# EAGLE design Sled_5A_v1 (EAGLE 9.6.2)
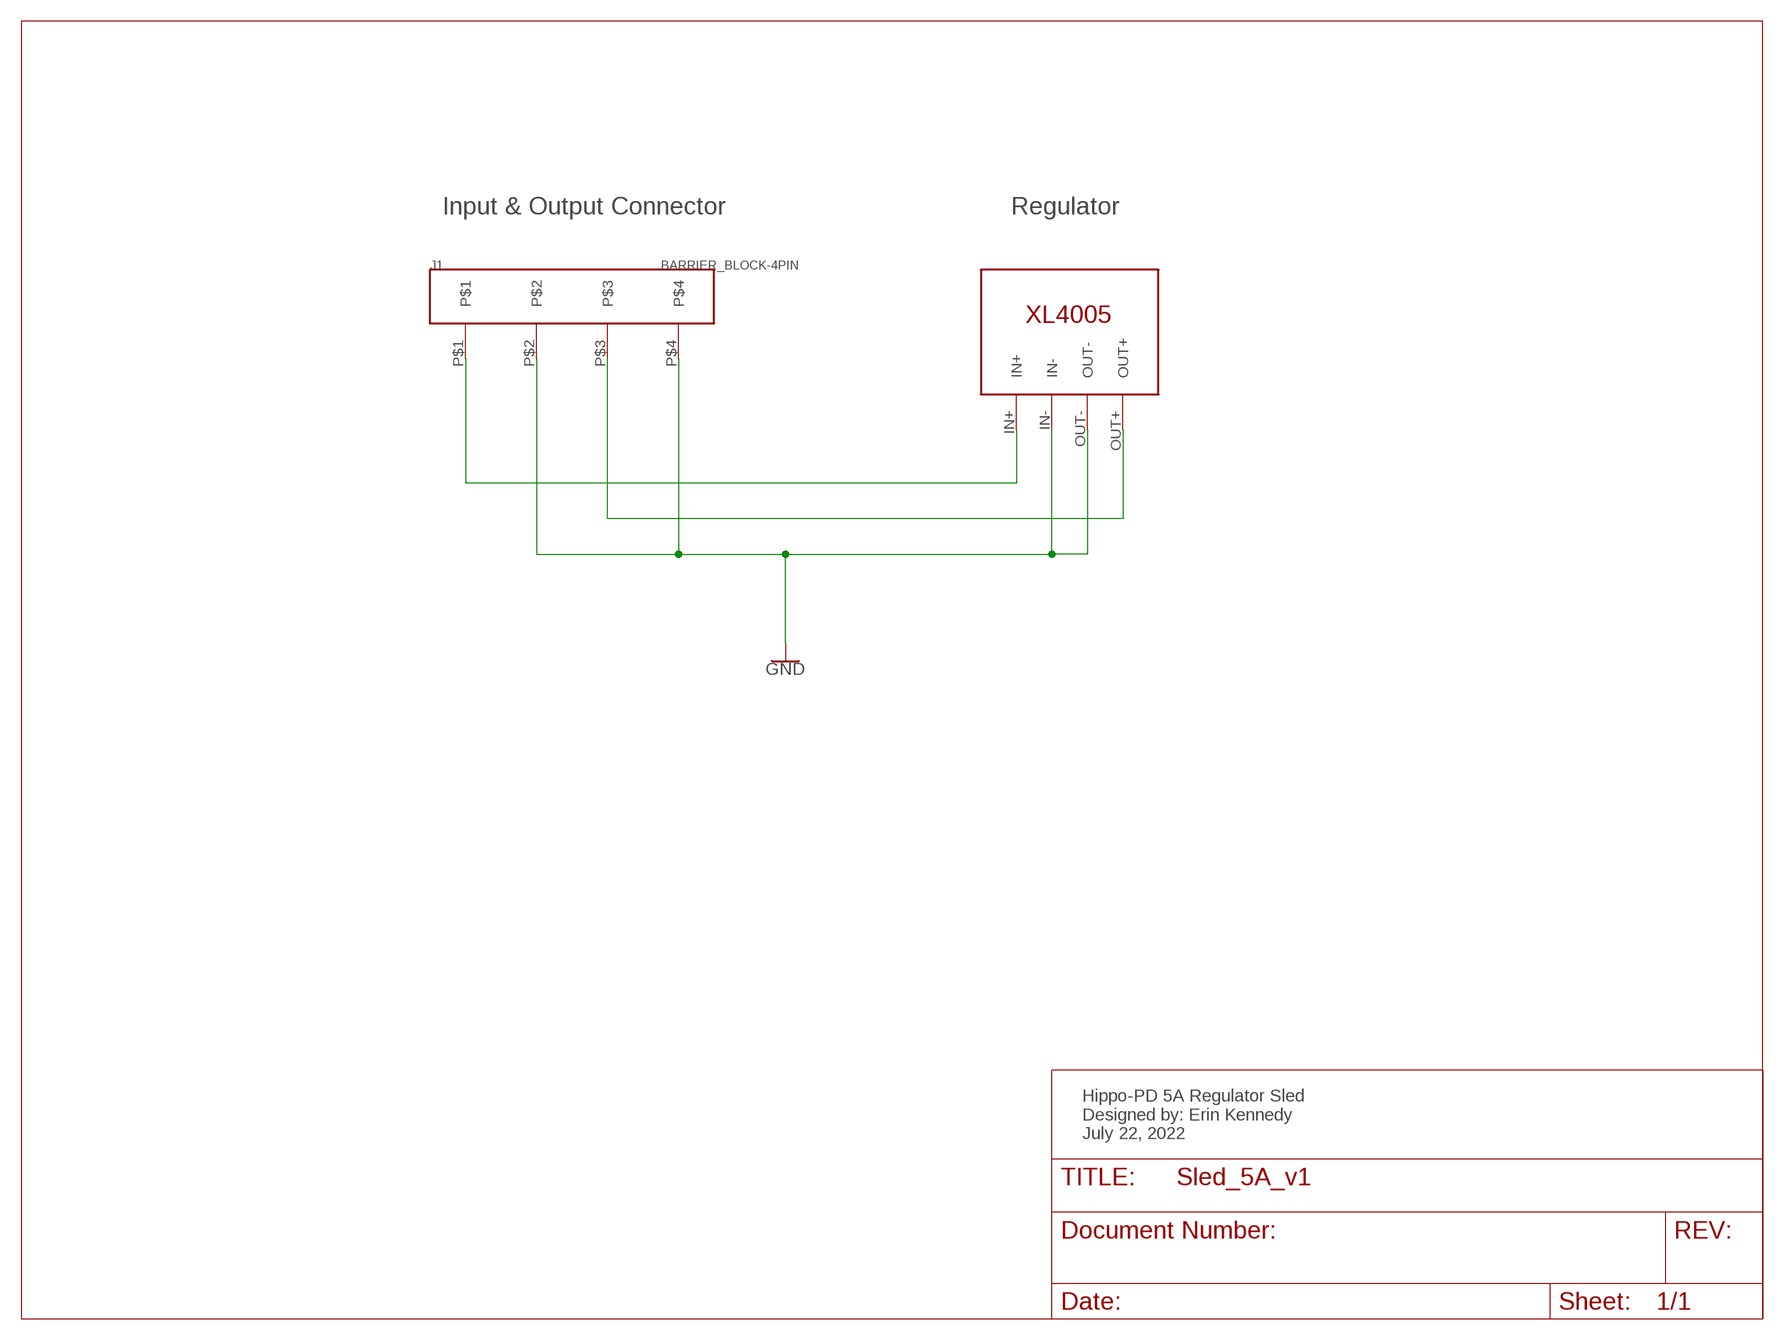
[diagram p0: schematic, sheet 1]

## Parts
J1  BARRIER_BLOCK-4PIN  [BARRIERBLOCK-4PIN]
U1  XL4005-DEV  [XL4005-DEV]

## Nets
GND: J1.P$2 J1.P$4 U1.IN- U1.OUT-
N$1: J1.P$1 U1.IN+
N$2: J1.P$3 U1.OUT+

## Notes on the sheet
- Input & Output Connector | Regulator
- Hippo-PD 5A Regulator Sled
  Designed by: Erin Kennedy
  July 22, 2022

## Library data of the parts
J1 = Hippo-PS:BARRIER_BLOCK-4PIN: Barrier block connector Digikey #ED2946-ND
U1 = Hippo-PS:XL4005-DEV

## Board
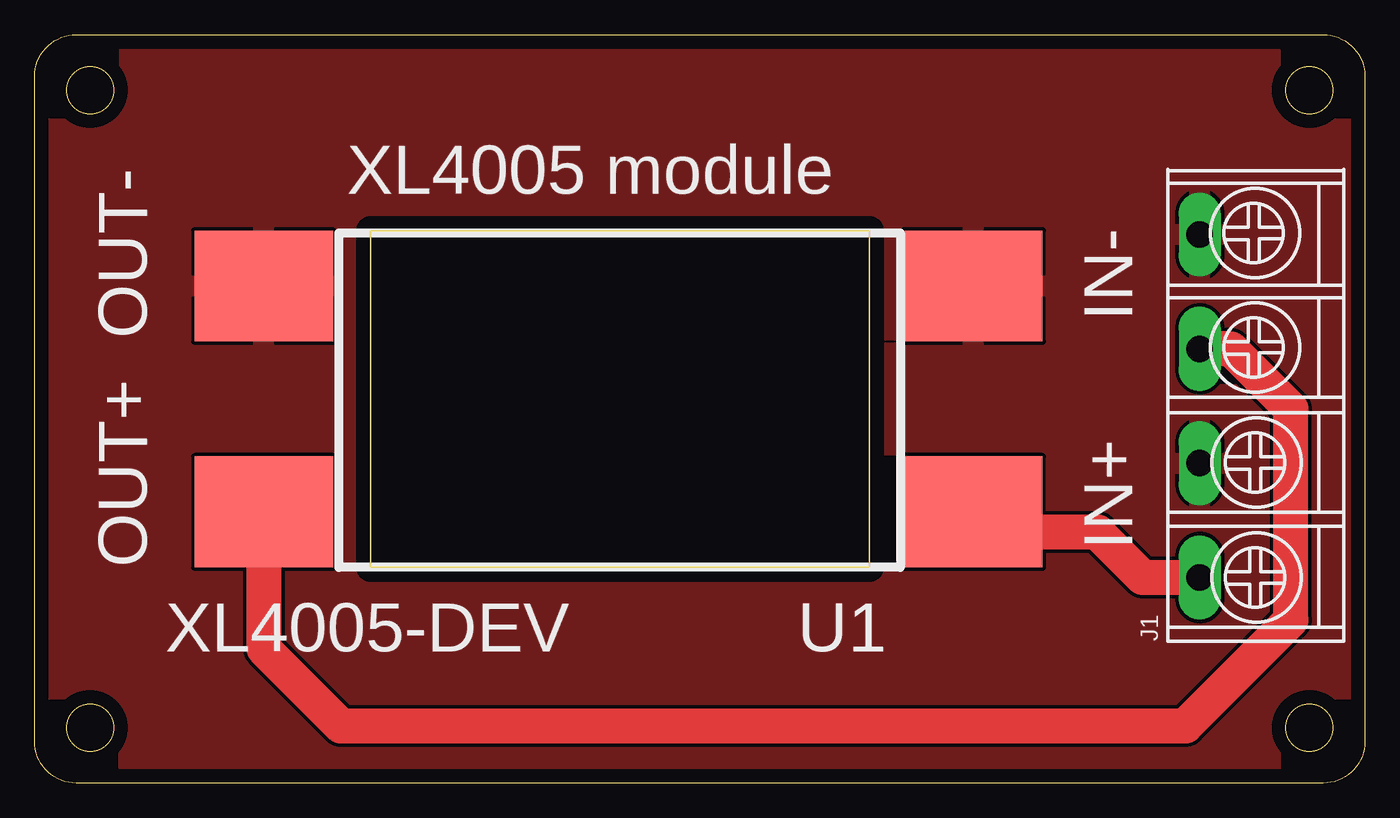
[diagram p1: board, top side]
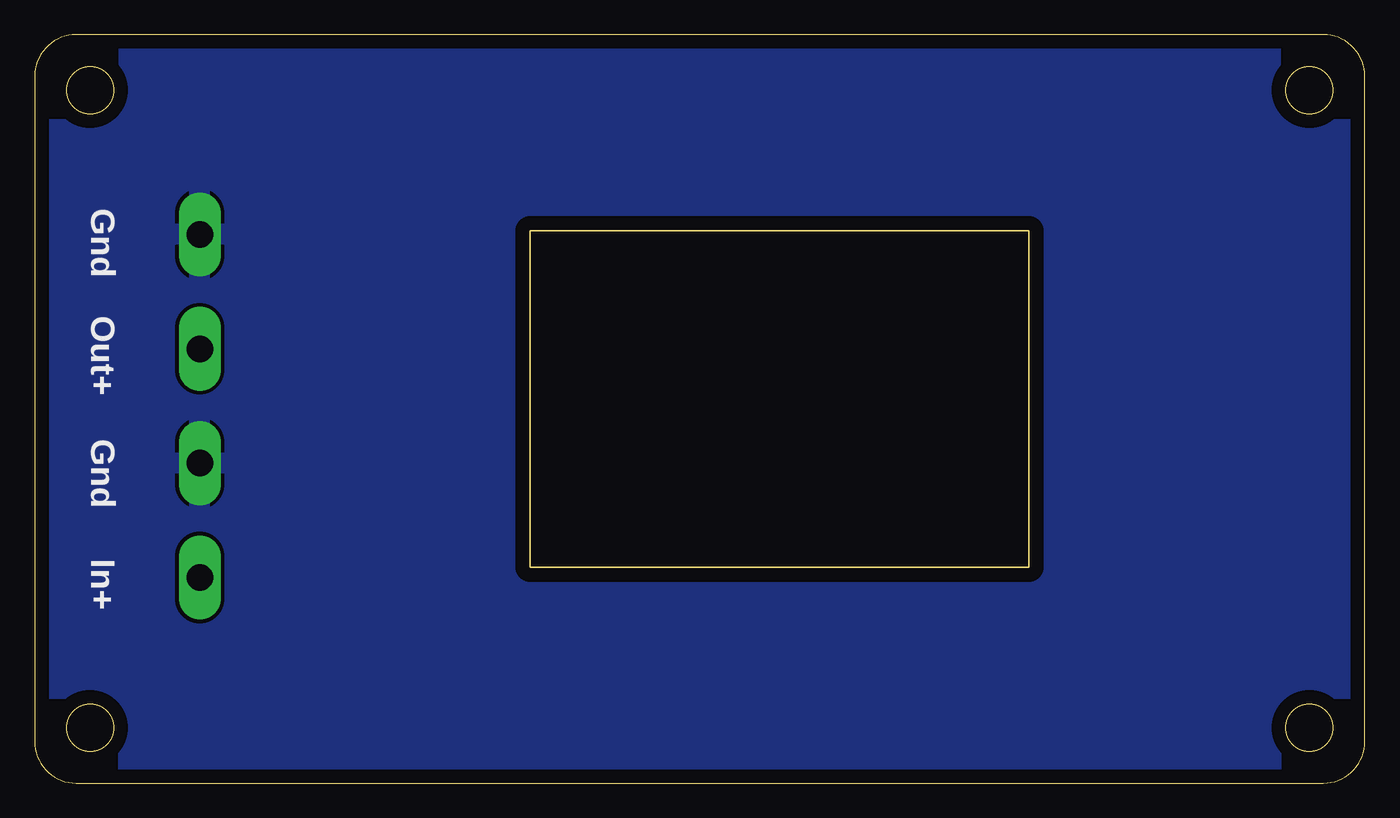
[diagram p2: board, bottom side, seen from below]

Size 96 x 54 mm. Coordinates in mm from the lower left corner, seen from the top.
Outline: 3,0 arc-90 0,3 0,51 arc-90 3,54 93,54 arc-90 96,51 96,3 arc-90 93,0 3,0
Outline: circle at 92,50 radius 1.7
Outline: circle at 4,4 radius 1.7
Outline: circle at 4,50 radius 1.7
Outline: circle at 92,4 radius 1.7
Copper layers (1*16): Top 0.035mm / dielectric 1.5mm / Bottom 0.035mm
Design rules "default *": minimum track width 8mil, minimum drill 0.35mm, track to track 10mil, track to pad 10mil, pad to pad 10mil, via to via 10mil, smd to smd 10mil, copper to edge 40mil, drill to drill 10mil, minimum pad ring 10mil, minimum via ring 8mil, stop-mask expansion 4mil, vias tented up to drill 0mil, thermal gap 10mil

### Footprints (pad centres in the part's own frame; a part is rotated, then mirrored left to right if it is on the bottom)
BARRIERBLOCK-4PIN = drill 1.905 pad 3.048 long: P$1 4.6,10.4; P$2 12.85,10.4; P$3 21.1,10.4; P$4 29.355,10.4
XL4005-DEV = smd 8 x 10: IN+ 4,-5; IN- 20.3,-5; OUT+ 4,46.2; OUT- 20.3,46.2

### Placement (x,y rotation side)
J1  94.48,10.24 90 top
U1  62.73,15.57 90 top

### Tracks (layer width: path | path; a pad name or v marks a point on that pad's centre or on a via)
GND
  pour Top: -7.12,62.56 102.1,62.56 102.1,-7.29 -10.93,-7.29 -10.93,62.56
  pour Bottom: -12.2,66.37 105.91,66.37 105.91,-9.83 -14.74,-9.83 -14.74,66.37
N$1
  Top 2.54: J1.P$1 79.98,14.84 76.7,18.11 66.54,18.11 67.73,19.3 U1.IN+
N$2
  Top 2.54: U1.OUT+ 16.53,9.7 22.09,4.14 83.05,4.14 90.67,11.76 90.67,27 86.34,31.34 J1.P$3

### Text on the board
tNames: word
bNames: Gnd | Out+ | Gnd | In+